# Altium schematic sheet 多功能电子密码锁.SchDoc
size A4
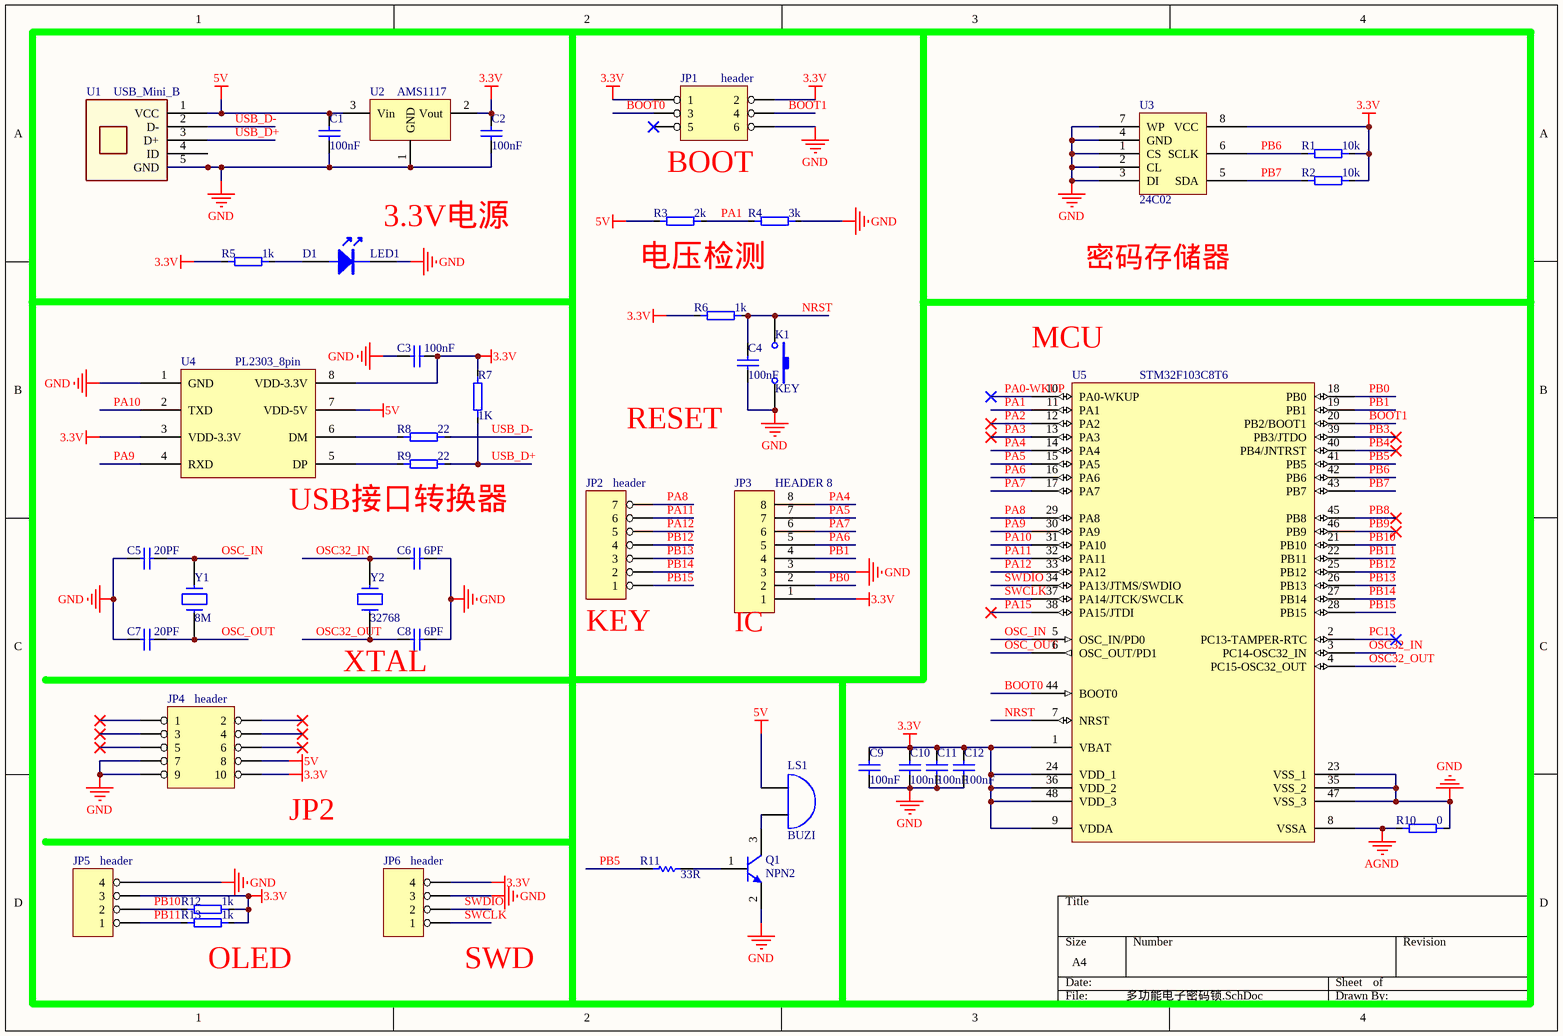
[diagram p0: 多功能电子密码锁.SchDoc]

## Parts
C1  100nF  [0603_C]
C2  100nF  [0603_C]
C3  100nF  [0603_C]
C4  100nF  [0603_C]
C5  20PF  [0603_C]
C6  6PF  [0603_C]
C7  20PF  [0603_C]
C8  6PF  [0603_C]
C9  100nF  [0603_C]
C10  100nF  [0603_C]
C11  100nF  [0603_C]
C12  100nF  [0603_C]
D1  LED1  [0603_LED]
JP1  header  [header2X3]
JP2  header  [header7]
JP3  HEADER 8  [HEADER8]
JP4  header  [header2X5]
JP5  header  [header4]
JP6  header  [header4]
K1  KEY  [KEY_2]
LS1  BUZI  [SPEAK_SMALL]
Q1  NPN2  [SOT-23-3]
R1  10k  [RES_0603]
R2  10k  [RES_0603]
R3  2k  [RES_0603]
R4  3k  [RES_0603]
R5  1k  [RES_0603]
R6  1k  [RES_0603]
R7  1K  [RES_0603]
R8  22  [RES_0603]
R9  22  [RES_0603]
R10  0  [RES_0603]
R11  33R  [RES_0603]
R12  1k  [RES_0603]
R13  1k  [RES_0603]
U1  USB_Mini_B  [USB_MINI_B_SMD]
U2  AMS1117  [SOT-223]
U3  24C02  [SOP_8]
U4  PL2303_8pin  [SOP_8]
U5  STM32F103C8T6  [LQFP48]
Y1  8M  [XTAL_2]
Y2  32768  [XTAL_32]

## Nets
3.3V: C2.2 C3.1 C9.1 C10.1 C11.1 C12.1 JP1.1 JP1.2 JP3.1 JP4.10 JP5.3 JP6.4 R1.2 R2.2 R5.1 R6.1 R7.2 R12.2 R13.2 U2.2(Vout) U3.8(VCC) U4.3(VDD-3.3V) U4.8(VDD-3.3V) U5.1(VBAT) U5.9(VDDA) U5.24(VDD_1) U5.36(VDD_2) U5.48(VDD_3)
5V: C1.2 JP4.8 LS1.1(A) R3.1 U1.1(VCC) U2.3(Vin) U4.7(VDD-5V)
AGND: R10.1 U5.8(VSSA)
GND: C1.1 C2.1 C3.2 C4.2 C5.1 C6.1 C7.1 C8.1 C9.2 C10.2 C11.2 C12.2 D1.2(K) JP1.6 JP3.3 JP4.7 JP4.9 JP5.4 JP6.3 K1.2 Q1.2(E) R4.2 R10.2 U1.5(GND) U2.1(GND) U3.1(CS) U3.2(CL) U3.3(DI) U3.4(GND) U3.7(WP) U4.1(GND) U5.23(VSS_1) U5.35(VSS_2) U5.47(VSS_3)
BOOT0: JP1.3 U5.44(BOOT0)
BOOT1: JP1.4 U5.20(PB2/BOOT1)
NRST: C4.1 K1.1 R6.2 U5.7(NRST)
OSC32_IN: C6.2 U5.3(PC14-OSC32_IN) Y2.2
OSC32_OUT: C8.2 U5.4(PC15-OSC32_OUT) Y2.1
OSC_IN: C5.2 U5.5(OSC_IN/PD0) Y1.1
OSC_OUT: C7.2 U5.6(OSC_OUT/PD1) Y1.2
PA0-WKUP: U5.10(PA0-WKUP)
PA1: R3.2 R4.1 U5.11(PA1)
PA2: U5.12(PA2)
PA3: U5.13(PA3)
PA4: JP3.8 U5.14(PA4)
PA5: JP3.7 U5.15(PA5)
PA6: JP3.5 U5.16(PA6)
PA7: JP3.6 U5.17(PA7)
PA8: JP2.7 U5.29(PA8)
PA9: U4.4(RXD) U5.30(PA9)
PA10: U4.2(TXD) U5.31(PA10)
PA11: JP2.6 U5.32(PA11)
PA12: JP2.5 U5.33(PA12)
PA15: U5.38(PA15/JTDI)
PB0: JP3.2 U5.18(PB0)
PB1: JP3.4 U5.19(PB1)
PB3: U5.39(PB3/JTDO)
PB4: U5.40(PB4/JNTRST)
PB5: R11.2 U5.41(PB5)
PB6: R1.1 U3.6(SCLK) U5.42(PB6)
PB7: R2.1 U3.5(SDA) U5.43(PB7)
PB8: U5.45(PB8)
PB9: U5.46(PB9)
PB10: JP5.2 R12.1 U5.21(PB10)
PB11: JP5.1 R13.1 U5.22(PB11)
PB12: JP2.4 U5.25(PB12)
PB13: JP2.3 U5.26(PB13)
PB14: JP2.2 U5.27(PB14)
PB15: JP2.1 U5.28(PB15)
PC13: U5.2(PC13-TAMPER-RTC)
SWCLK: JP6.1 U5.37(PA14/JTCK/SWCLK)
SWDIO: JP6.2 U5.34(PA13/JTMS/SWDIO)
USB_D+: R7.1 R9.2 U1.3(D+)
USB_D-: R8.2 U1.2(D-)
NetD1_1: D1.1(A) R5.2
NetLS1_2: LS1.2(B) Q1.3(C)
NetQ1_1: Q1.1(B) R11.1
NetR8_1: R8.1 U4.6(DM)
NetR9_1: R9.1 U4.5(DP)

Not connected (* = marked no-connect by the designer): JP1 5*; JP4 1* 2* 3* 4* 5* 6*; U1 4(ID)

## Notes on the sheet
- (near JP1) BOOT
- (near D1) 3.3V电源
- (near R3) 电压检测
- 密码存储器
- (near U5) MCU
- RESET
- USB接口转换器
- (near JP2) KEY
- (near JP3) IC
- (near C8) XTAL
- JP2
- OLED
- (near JP6) SWD

## Library data of the parts
C1-C12 = CAP: Capacitor; Value: 104; Published: 8-Jun-2000; LatestRevisionDate: 17-Jul-2002; LatestRevisionNote: Re-released for DXP Platform.; PackageReference: RAD-0.3; Publisher: Altium Limited
JP1 = HEADER 3X2
JP2 = HEADER 7
JP4 = HEADER 5X2
JP5 JP6 = HEADER 4
K1 = KEY_2: Switch; Published: 24-Mar-1999; LatestRevisionDate: 17-Jul-2002; LatestRevisionNote: Re-released for DXP Platform.; PackageReference: SPST-2; Publisher: Altium Limited
LS1 = Bell: Electrical Bell; Published: 24-Mar-1999; LatestRevisionDate: 17-Jul-2002; LatestRevisionNote: Re-released for DXP Platform.; PackageReference: PIN2; Publisher: Altium Limited
Q1 = NPN2: 贴片
R1-R10 R12 R13 = RES1
R11 = RES: Resistor; Revision: July-2002: Re-released for DXP Platform.
U1 = USB_Mini_B: Model: 54819-0578; OrderNr: 418-0172; Maker: Molex; Distributor: RS; Price: 4,29 (5)
U2 = AMS1117: 3.3V电压转换器AMS1117
U3 = 24C**
U4 = PL2303-8pin: USB转232
U5 = STM32F103C8T6: STM32 ARM-based 32-bit MCU with 64 Kbytes Flash, 48-pin LQFP, Industrial Temperature; Published: 30-May-2008; DatasheetVersion: rev6, Mar-2008; PackageVersion: Mar-2008; PackageReference: LQFP48; Publisher: Altium Limited; PackageDescription: 48-Pin Low-Profile Quad Flat Pack, 7 x 7 mm Body, 0.5 mm Pitch (LQFP48); ComponentLink1Description: Manufacturer Link; ComponentLink1URL: www.st.com/stm32; ComponentLink2Description: Datasheet; ComponentLink2URL: http://www.st.com/stonline/products/literature/ds/13587.pdf
Y1 Y2 = XTAL32